# Altium schematic sheet Ethernet.SchDoc
size A; SheetNumber: 2; SheetTotal: 11
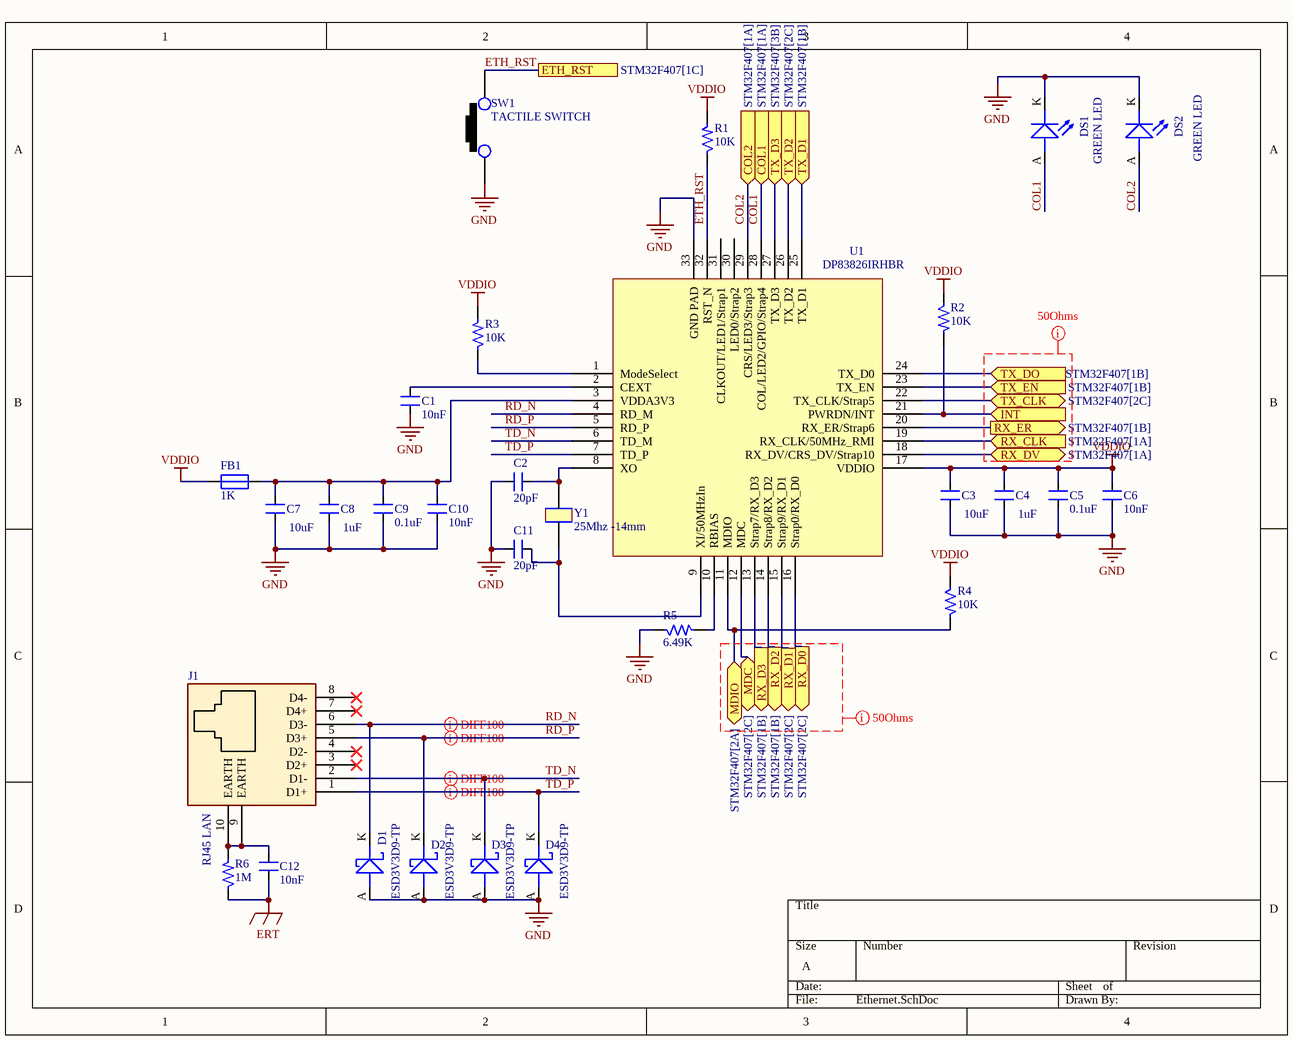
[diagram p0: Ethernet.SchDoc]

## Parts
C1  10nF  [CAP_0805]
C2  20pF  [CAP_0805]
C3  10uF  [CAP_1206]
C4  1uF  [CAP_0805]
C5  0.1uF  [CAP_0805]
C6  10nF  [CAP_0805]
C7  10uF  [CAP_1206]
C8  1uF  [CAP_0805]
C9  0.1uF  [CAP_0805]
C10  10nF  [CAP_0805]
C11  20pF  [CAP_0805]
C12  10nF  [CAP_P196_102X287_H332_RAD_TH]
D1  ESD3V3D9-TP  [DIO_SOD-923]
D2  ESD3V3D9-TP  [DIO_SOD-923]
D3  ESD3V3D9-TP  [DIO_SOD-923]
D4  ESD3V3D9-TP  [DIO_SOD-923]
DS1  GREEN LED  [LED_0805]
DS2  GREEN LED  [LED_0805]
FB1  1K  [IND_0805]
J1  RJ45 LAN  [CON10_P106_RJ45_TH_ST]
R1  10K  [RES_0805]
R2  10K  [RES_0603]
R3  10K  [RES_0805]
R4  10K  [RES_0603]
R5  6.49K  [RES_0805]
R6  1M  [RES_1206]
SW1  TACTILE SWITCH  [SW_342_SMD]
U1  DP83826IRHBR  [VQFN32_19_218_23X9_SMD]
Y1  25Mhz -14mm  [XTAL_314_240X47_SMD]

## Ports
COL1 (in, see STM32F407[1A]), COL2 (in, see STM32F407[1A]), ETH_RST (see STM32F407[1C]), INT (in), MDC (bidir, see STM32F407[2C]), MDIO (bidir, see STM32F407[2A]), RX_CLK (in, see STM32F407[1A]), RX_D0 (out, see STM32F407[2C]), RX_D1 (out, see STM32F407[2C]), RX_D2 (out, see STM32F407[1B]), RX_D3 (out, see STM32F407[1B]), RX_DV (bidir, see STM32F407[1A]), RX_ER (out, see STM32F407[1B]), TX_CLK (bidir, see STM32F407[2C]), TX_D1 (in, see STM32F407[1B]), TX_D2 (in, see STM32F407[2C]), TX_D3 (in, see STM32F407[3B]), TX_DO (in, see STM32F407[1B]), TX_EN (in, see STM32F407[1B])

## Nets
ERT: C12.1 R6.1
GND: C1.1 C2.1 C3.1 C4.1 C5.1 C6.1 C7.1 C8.1 C9.1 C10.1 C11.1 D1.A D2.A D3.A D4.A DS1.K(CATHODE) DS2.K(CATHODE) R5.1 SW1.1 U1.33(GND_PAD)
VDDIO: C3.2 C4.2 C5.2 C6.2 FB1.1 R1.2 R2.1 R3.2 R4.1 U1.17(VDDIO)
COL1: DS1.A(ANODE) U1.28(COL/LED2/GPIO/Strap4) ; port COL1
COL2: DS2.A(ANODE) U1.29(CRS/LED3/Strap3) ; port COL2
ETH_RST: R1.1 SW1.2 U1.32(RST_N) ; port ETH_RST
INT: R2.2 U1.21(PWRDN/INT) ; port INT
MDC: U1.12(MDC) ; port MDC
MDIO: R4.2 U1.11(MDIO) ; port MDIO
RD_N: D1.K J1.6(D3-) U1.4(RD_M)
RD_P: D2.K J1.5(D3+) U1.5(RD_P)
RX_CLK: U1.19(RX_CLK/50MHz_RMI) ; port RX_CLK
RX_D0: U1.16(Strap0/RX_D0) ; port RX_D0
RX_D1: U1.15(Strap9/RX_D1) ; port RX_D1
RX_D2: U1.14(Strap8/RX_D2) ; port RX_D2
RX_D3: U1.13(Strap7/RX_D3) ; port RX_D3
RX_DV: U1.18(RX_DV/CRS_DV/Strap10) ; port RX_DV
RX_ER: U1.20(RX_ER/Strap6) ; port RX_ER
TD_N: D3.K J1.2(D1-) U1.6(TD_M)
TD_P: D4.K J1.1(D1+) U1.7(TD_P)
TX_CLK: U1.22(TX_CLK/Strap5) ; port TX_CLK
TX_D1: U1.25(TX_D1) ; port TX_D1
TX_D2: U1.26(TX_D2) ; port TX_D2
TX_D3: U1.27(TX_D3) ; port TX_D3
TX_DO: U1.24(TX_D0) ; port TX_DO
TX_EN: U1.23(TX_EN) ; port TX_EN
NetC1_2: C1.2 U1.2(CEXT)
NetC2_2: C2.2 U1.8(XO) Y1.1
NetC7_2: C7.2 C8.2 C9.2 C10.2 FB1.2 U1.3(VDDA3V3)
NetC11_2: C11.2 U1.9(XI/50MHzIn) Y1.2
NetC12_2: C12.2 J1.9(EARTH) J1.10(EARTH) R6.2
NetR3_1: R3.1 U1.1(ModeSelect)
NetR5_2: R5.2 U1.10(RBIAS)

Not connected (* = marked no-connect by the designer): J1 3(D2+)* 4(D2-)* 7(D4+)* 8(D4-)*; U1 30(LED0/Strap2) 31(CLKOUT/LED1/Strap1)

## Layout directives
differential pair; differential pair class *DIFF100: RD_N, RD_P, TD_N, TD_P
net class *50Ohms: (no net found under the mark)

## Library data of the parts
C1 C6 C10 = CAP_10nF-50V-10%-0805: 10000pF ±10% 50V Ceramic Capacitor X7R 0805 (2012 Metric); Manufacturer: Samsung; Manufacturer Part Number: C0805C103K5RECAUTO; Alternate Part Number-1: GRM2195C1H103JA01D; Case/Package: 0805; Supplier-1: SIRICOM; Supplier Part Number-1: 0805B103K500CT
C2 C11 = CAP_20pF-50V-10%-0805: ±10% 50V Ceramic Capacitor C0G, NP0 0805 (2012 Metric); Manufacturer: AVX Corporation; Manufacturer Part Number: 08055A200KAT2A; Alternate Part Number-1: NA; Case/Package: 0805; Supplier-1: Digikey; Supplier Part Number-1: 478-11887-1-ND - Cut Tape (CT)
C3 C7 = CAP_10uF-50V-10%-1206: 10µF ±10% 50V Ceramic Capacitor X7R 1206 (3216 Metric); Manufacturer: KEMET; Manufacturer Part Number: CL31B106KBHNNNE; Alternate Part Number-1: GRT31CR61H106ME01L; Case/Package: 1206; Supplier-1: SIRICOM; Supplier Part Number-1: CC1206KKX5R9BB106
C4 C8 = CAP_1uF-50V-5%-0805: 1µF ±5% 50V Ceramic Capacitor X7R 0805 (2012 Metric); Manufacturer: Samsung; Manufacturer Part Number: CC0805JKX7R9BB105; Alternate Part Number-1: 0805F105M500NT; Case/Package: 0805; Supplier-1: SIRICOM; Supplier Part Number-1: CL21B105KBFNNNE
C5 C9 = CAP_0.1uF-50V-5%-0805: 0.1µF ±5% 50V Ceramic Capacitor X7R 0805 (2012 Metric); Manufacturer: AVX Corporation; Manufacturer Part Number: 08055C104JAT4A; Alternate Part Number-1: 0805B104M500; Case/Package: 0805; Supplier-1: SIRICOM; Supplier Part Number-1: 0805B104J500CT
C12 = CAP_10nF-1KV-10%-RAD-TH: 10000pF ±10% 1000V (1kV) Ceramic Capacitor X7R Radial; Manufacturer: Yageo; Manufacturer Part Number: RDER73A103K2K1H03B; Alternate Part Number-1: NA; Case/Package: TH; Supplier-1: SP ROAD; Supplier Part Number-1: RDER73A103K2K1H03B
D1-D4 = DIO-T_3.3V-8.8V-10A-SOD923: TVS DIODE 3.3V 8.8V SOD923; Manufacturer: Micro Commercial Co; Alternate Part Number-1: NA; Manufacturer Part Number: ESD3V3D9-TP; Case/Package: SOD923; Supplier-1: Digikey; Supplier Part Number-1: ESD3V3D9-TPMSTR-ND
DS1 DS2 = LED_GREEN-2.2-20mA-0805: Green 569nm LED Indication - Discrete 2.1V 0805 (2012 Metric); Manufacturer: Vishay Lite-On; Manufacturer Part Number: LTST-C171GKT; Alternate Part Number-1: NA; Case/Package: 0805; Supplier-1: SP ROAD; Supplier Part Number-1: LTST-C171GKT
FB1 = FB_1K-100MHZ-1.6A-0805: 1 kOhms @ 100MHz 1 Power Line Ferrite Bead 0805 (2012 Metric) 1.6A; Manufacturer: Laird; Manufacturer Part Number: BLM21SP102SH1D; Alternate Part Number-1: NA; Case/Package: 0805; Supplier-1: SIRICOM; Supplier Part Number-1: ACMS201209A102
J1 = CON-SKT-RJ_8C8P-RA-TH: 8 Pins, 2 Row 2.54mm Pitch, right angle Connector, male; Manufacturer: Assmann; Manufacturer Part Number: A-2004-2-4-LPS-N-R; Alternate Part Number-1: NA; Case/Package: TH-CON; Supplier-1: SP ROAD; Supplier Part Number-1: A-2004-2-4-LPS-N-R
R1 R3 = RES_10K-0.125W-1%-0805: 10 kOhms ±1% 0.125W, 1/8W Chip Resistor 0805 (2012 Metric) Automotive AEC-Q200 Thick Film; Manufacturer: CTS; Manufacturer Part Number: WR08X1002FTL; Case/Package: 0805; Supplier-1: SIRICOM; Supplier Part Number-1: WR08X1002FTL; Alternate Part Number-1: WR08X1002FTL
R2 R4 = RES_10K-0.1W-1%-0603: 10 kOhms ±1% 0.1W, 1/10W Chip Resistor 0603 (1608 Metric) Automotive AEC-Q200 Thick Film; Manufacturer: Walsin; Manufacturer Part Number: WR06X1002FTL; Alternate Part Number-1: 0603WAJ0103T5E; Case/Package: 0603; Supplier-1: SIRICOM; Supplier Part Number-1: WR06X1002FTL
R5 = RES_6.49K-0.125W-1%-0805: 6.49 kOhms ±1% 0.125W, 1/8W Chip Resistor 0805 (2012 Metric) Moisture Resistant Thick Film; Manufacturer: Stackpole Electronics; Manufacturer Part Number: RC0805FR-076K49L; Alternate Part Number-1: NA; Case/Package: 0805; Supplier-1: SIRICOM; Supplier Part Number-1: WRO8X6491FTL
R6 = RES_1M-0.25W-1%-1206: 1 MOhms ±1% 0.25W, 1/4W Chip Resistor 1206 (3216 Metric) Automotive AEC-Q200, High Voltage Thick Film; Manufacturer: Walsin; Manufacturer Part Number: WR12X1004FTL; Alternate Part Number-1: NA; Case/Package: 1206; Supplier-1: SIRICOM; Supplier Part Number-1: WR12X1004FTL
SW1 = SW1_RS-282G05A3-SMRT-SMD: Tactile Switch SPST-NO Top Actuated Surface Mount; Manufacturer: ITT C&K; Alternate Part Number-1: NA; Manufacturer Part Number: RS-282G05A3-SMRT; Case/Package: SMD; Supplier-1: SP ROAD; Supplier Part Number-1: RS-282G05A3-SMRT
U1 = IC_DP83826IRHBR: Ethernet ICs Low latency 10/100-Mbps PHY, MII interface and enhanced mode with an industrial temperature range 32-VQFN -40 to 85; Manufacturer: Texas Instruments; Alternate Part Number-1: NA; Manufacturer Part Number: DP83826IRHBR; Case/Package: 32-VQFN; Supplier-1: Mouser; Supplier Part Number-1: 595-DP83826IRHBR
Y1 = XTAL_25Mhz-FOXSDLF/250F-20: 25MHz ±30ppm Crystal 20pF 30 Ohms HC-49/US; Manufacturer: Abracon; Alternate Part Number-1: NA; Manufacturer Part Number: FOXSDLF/250F-20; Case/Package: SMD; Supplier-1: MOUSER; Supplier Part Number-1: FOXSDLF/250F-20